# EAGLE schematic surfaceRX (EAGLE 6.2)
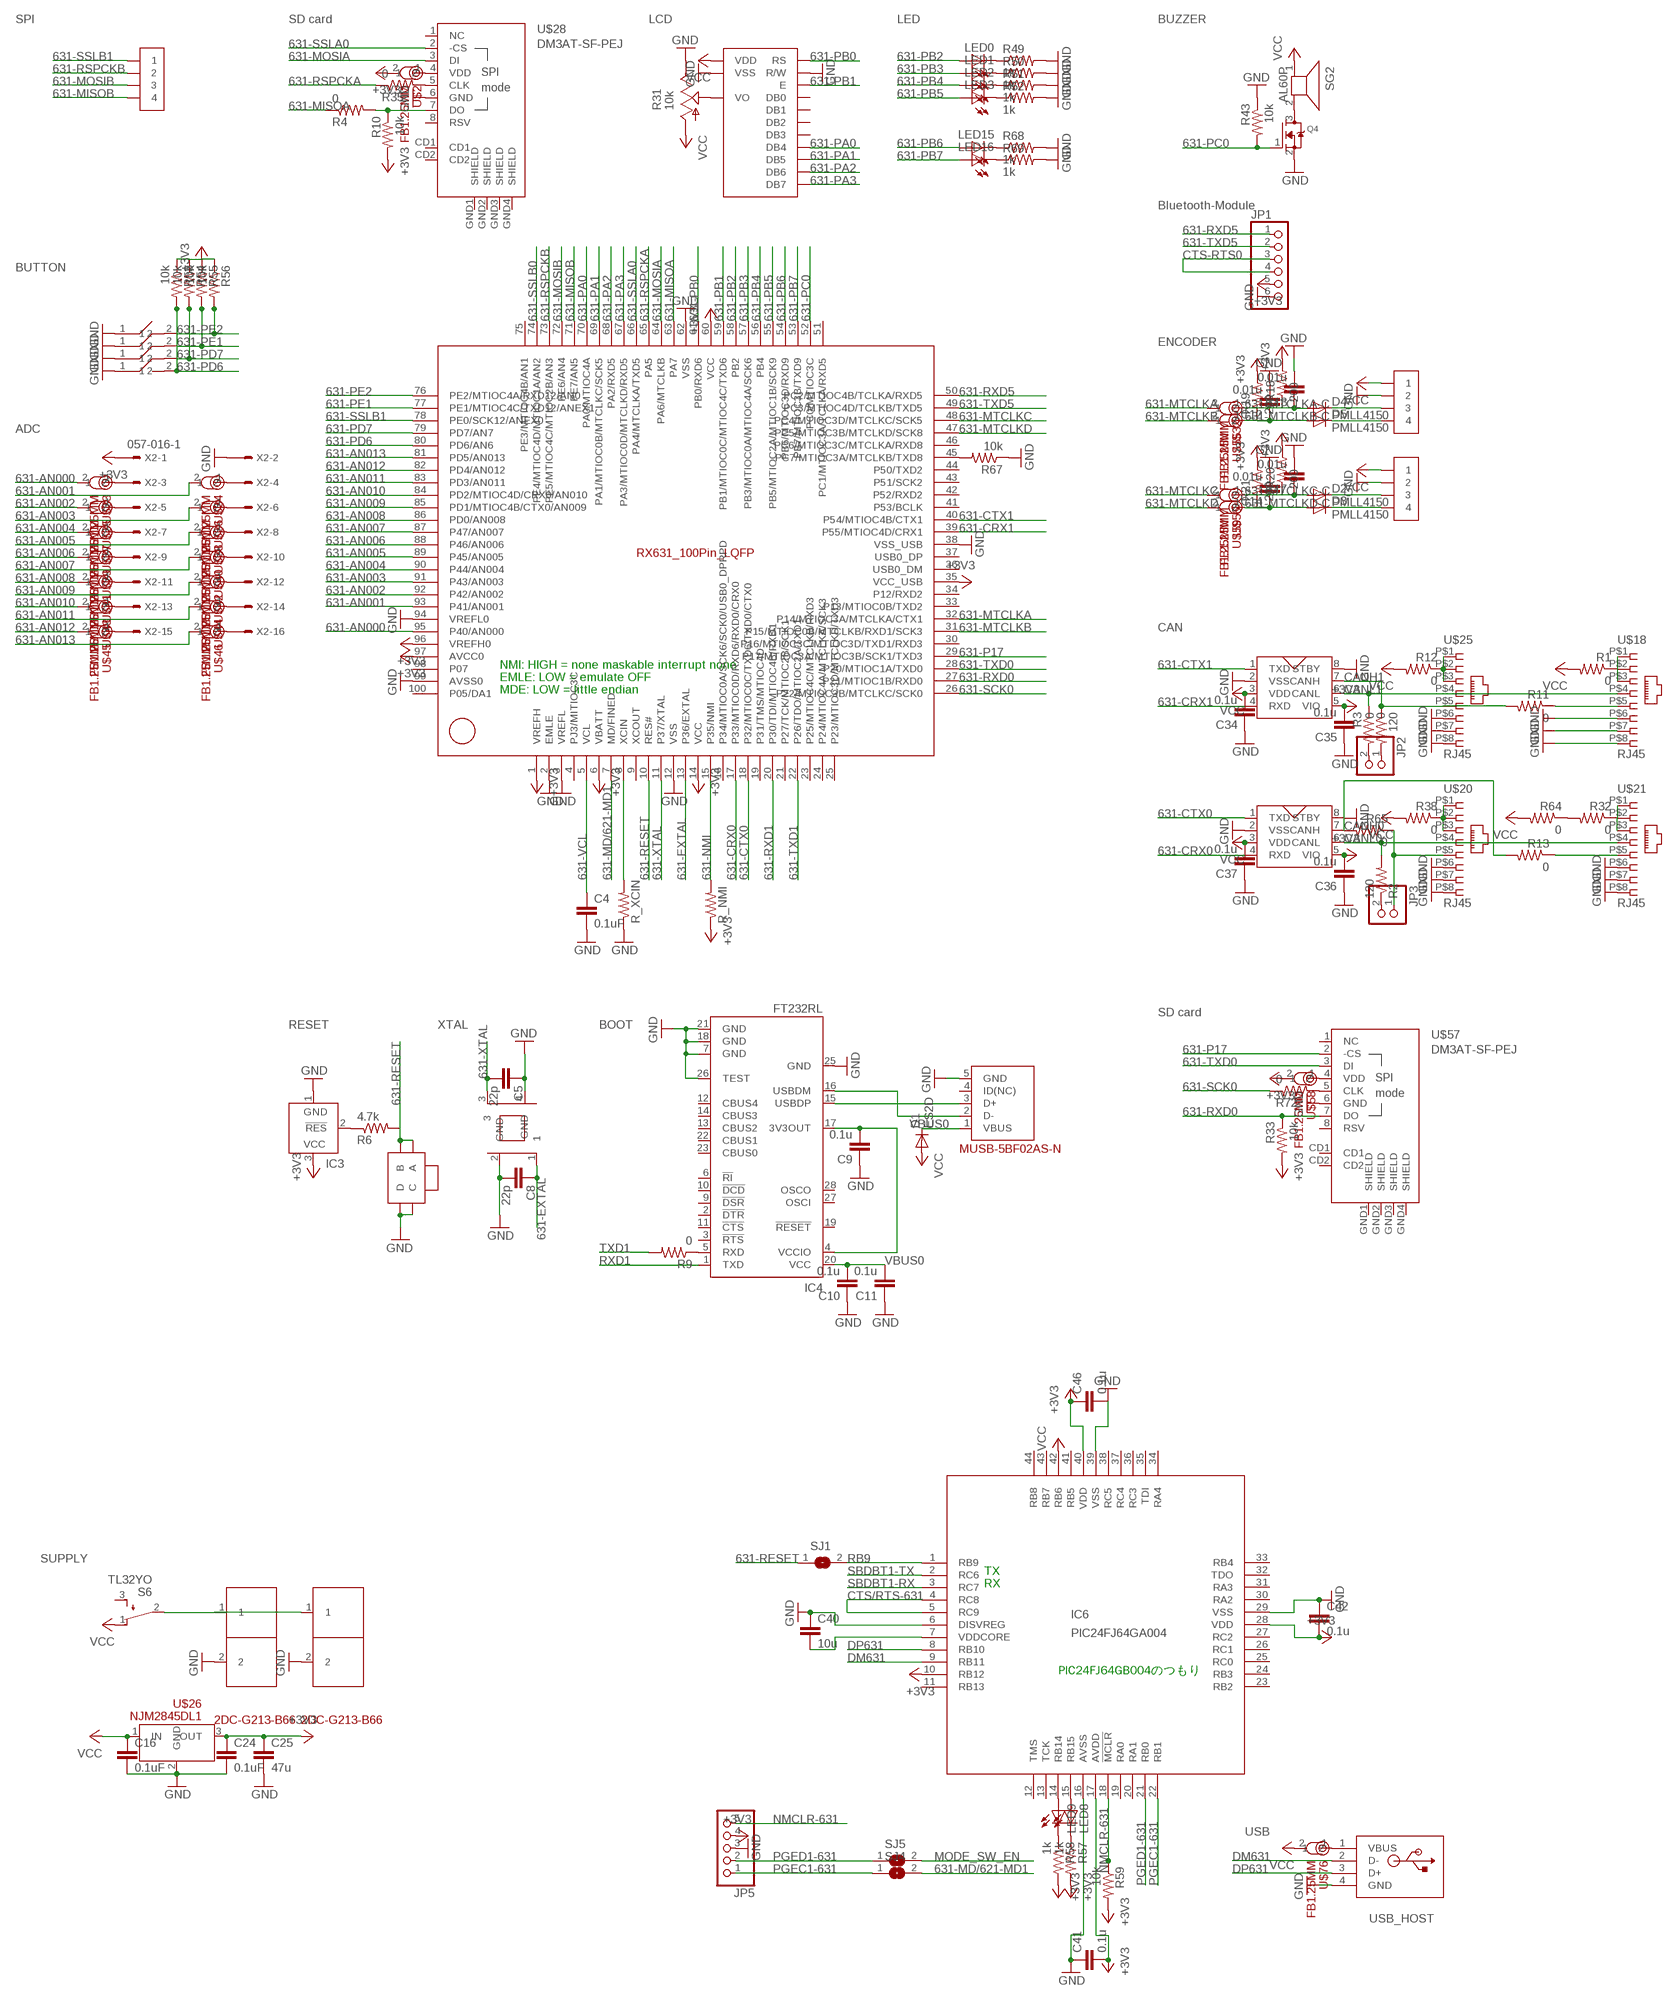
[diagram p0: schematic, sheet 1, part 1 of 2]
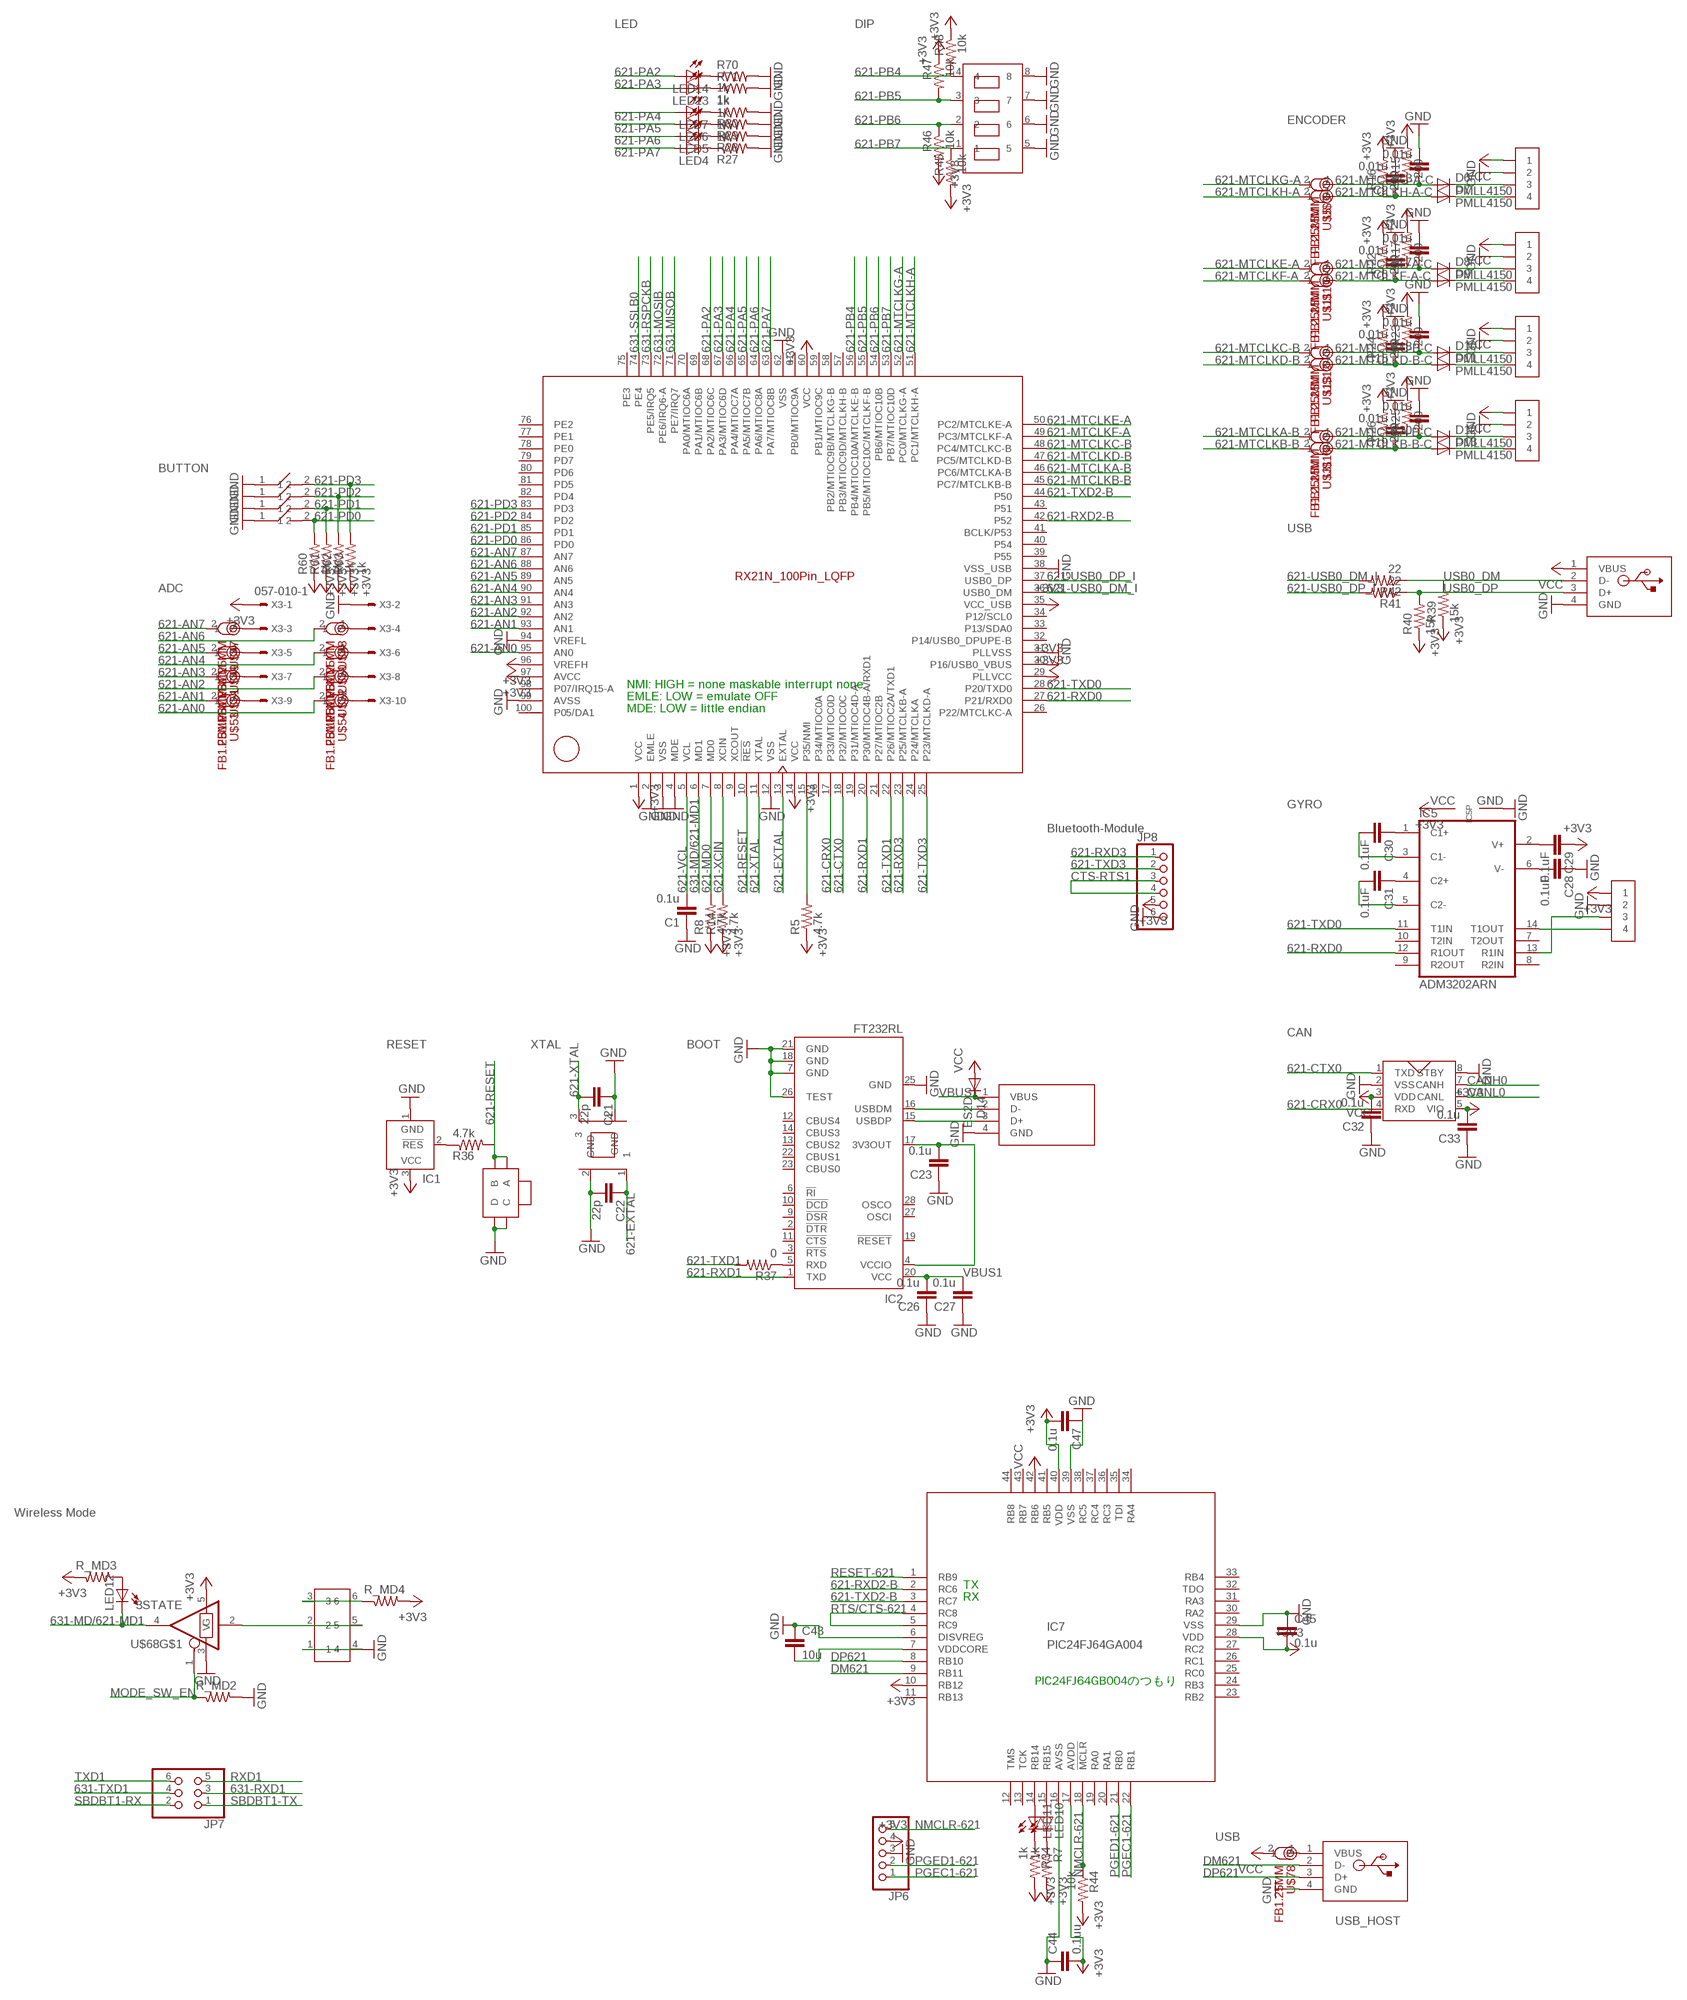
[diagram p1: schematic, sheet 1, part 2 of 2]

## Parts
0  120  R-US_MELF0102W  [MINI_MELF-0102W]
C1  0.1u  C-EUC0402  [C0402]
C2  0.01u  C-EUC0402  [C0402]
C3  0.01u  C-EUC0402  [C0402]
C4  0.1uF  C-EUC0603K  [C0603K]
C5  22p  C-EUC0603K  [C0603K]
C6  0.01u  C-EUC0402  [C0402]
C7  0.01u  C-EUC0402  [C0402]
C8  22p  C-EUC0603K  [C0603K]
C9  0.1u  C-EUC0402  [C0402]
C10  0.1u  C-EUC0402  [C0402]
C11  0.1u  C-EUC0402  [C0402]
C12  0.01u  C-EUC0402  [C0402]
C13  0.01u  C-EUC0402  [C0402]
C14  0.01u  C-EUC0402  [C0402]
C15  0.01u  C-EUC0402  [C0402]
C16  0.1uF  C-EUC0603K  [C0603K]
C17  0.01u  C-EUC0402  [C0402]
C18  0.01u  C-EUC0402  [C0402]
C19  0.01u  C-EUC0402  [C0402]
C20  0.01u  C-EUC0402  [C0402]
C21  22p  C-EUC0603K  [C0603K]
C22  22p  C-EUC0603K  [C0603K]
C23  0.1u  C-EUC0402  [C0402]
C24  0.1uF  C-EUC0603K  [C0603K]
C25  47u  C-EUC3225  [C3225]
C26  0.1u  C-EUC0402  [C0402]
C27  0.1u  C-EUC0402  [C0402]
C28  0.1uF  C-EUC0603K  [C0603K]
C29  0.1uF  C-EUC0603K  [C0603K]
C30  0.1uF  C-EUC0603K  [C0603K]
C31  0.1uF  C-EUC0603K  [C0603K]
C32  0.1u  C-EUC0402  [C0402]
C33  0.1u  C-EUC0402  [C0402]
C34  0.1u  C-EUC0402  [C0402]
C35  0.1u  C-EUC0402  [C0402]
C36  0.1u  C-EUC0402  [C0402]
C37  0.1u  C-EUC0402  [C0402]
C40  10u  C-EUC0603K  [C0603K]
C41  0.1u  C-EUC0603K  [C0603K]
C42  0.1u  C-EUC0603K  [C0603K]
C43  10u  C-EUC0603K  [C0603K]
C44  0.1uu  C-EUC0603K  [C0603K]
C45  0.1u  C-EUC0603K  [C0603K]
C46  0.1u  C-EUC0603K  [C0603K]
C47  0.1u  C-EUC0603K  [C0603K]
D1  ES2D  [SMB]
D2  PMLL4150  [SOD80C]
D3  PMLL4150  [SOD80C]
D4  PMLL4150  [SOD80C]
D5  PMLL4150  [SOD80C]
D6  PMLL4150  [SOD80C]
D7  PMLL4150  [SOD80C]
D8  PMLL4150  [SOD80C]
D9  PMLL4150  [SOD80C]
D10  PMLL4150  [SOD80C]
D11  PMLL4150  [SOD80C]
D12  PMLL4150  [SOD80C]
D13  PMLL4150  [SOD80C]
D14  ES2D  [SMB]
IC1  TCM809  [SOT23B-3]
IC2  FT232RL  [SSOP28]
IC3  TCM809  [SOT23B-3]
IC4  FT232RL  [SSOP28]
IC5  ADM3202ARN  [SO16]
IC6  PIC24FJ64GA004  [TQFP44]
IC7  PIC24FJ64GA004  [TQFP44]
JP1  PINHD-1X6  [1X06]
JP2  PINHD-1X2  [1X02]
JP3  PINHD-1X2  [1X02]
JP5  PINHD-1X5  [1X05]
JP6  PINHD-1X5  [1X05]
JP7  PINHD-2X3  [2X03]
JP8  PINHD-1X6  [1X06]
LED0  LEDSML0805  [SML0805]
LED1  LEDSML0805  [SML0805]
LED2  LEDSML0805  [SML0805]
LED3  LEDSML0805  [SML0805]
LED4  LEDSML0805  [SML0805]
LED5  LEDSML0805  [SML0805]
LED6  LEDSML0805  [SML0805]
LED7  LEDSML0805  [SML0805]
LED8  LEDSML0805  [SML0805]
LED9  LEDSML0805  [SML0805]
LED10  LEDSML0805  [SML0805]
LED11  LEDSML0805  [SML0805]
LED12  LEDSML0805  [SML0805]
LED13  LEDSML0805  [SML0805]
LED14  LEDSML0805  [SML0805]
LED15  LEDSML0805  [SML0805]
LED16  LEDSML0805  [SML0805]
MCU1  R5F562N8BDFP  [LQFP100]
Q4  MOSFET-NREFLOW  [SOT23]
R1  0  R-US_MELF0102W  [MINI_MELF-0102W]
R2  120  R-US_MELF0102W  [MINI_MELF-0102W]
R3  0  R-US_MELF0102W  [MINI_MELF-0102W]
R4  0  R-US_MELF0102W  [MINI_MELF-0102W]
R5  4.7k  R-US_MELF0102W  [MINI_MELF-0102W]
R6  4.7k  R-US_MELF0102W  [MINI_MELF-0102W]
R7  1k  R-US_MELF0102W  [MINI_MELF-0102W]
R8  4.7k  R-US_MELF0102W  [MINI_MELF-0102W]
R9  0  R-US_MELF0102W  [MINI_MELF-0102W]
R10  10k  R-US_MELF0102W  [MINI_MELF-0102W]
R11  0  R-US_MELF0102W  [MINI_MELF-0102W]
R12  0  R-US_MELF0102W  [MINI_MELF-0102W]
R13  0  R-US_MELF0102W  [MINI_MELF-0102W]
R14  4.7k  R-US_MELF0102W  [MINI_MELF-0102W]
R15  200  R-US_MELF0102W  [MINI_MELF-0102W]
R16  200  R-US_MELF0102W  [MINI_MELF-0102W]
R17  200  R-US_MELF0102W  [MINI_MELF-0102W]
R18  200  R-US_MELF0102W  [MINI_MELF-0102W]
R19  200  R-US_MELF0102W  [MINI_MELF-0102W]
R20  200  R-US_MELF0102W  [MINI_MELF-0102W]
R21  200  R-US_MELF0102W  [MINI_MELF-0102W]
R22  200  R-US_MELF0102W  [MINI_MELF-0102W]
R23  200  R-US_MELF0102W  [MINI_MELF-0102W]
R24  200  R-US_MELF0102W  [MINI_MELF-0102W]
R25  200  R-US_MELF0102W  [MINI_MELF-0102W]
R26  200  R-US_MELF0102W  [MINI_MELF-0102W]
R27  1k  R-US_MELF0102W  [MINI_MELF-0102W]
R28  1k  R-US_MELF0102W  [MINI_MELF-0102W]
R29  1k  R-US_MELF0102W  [MINI_MELF-0102W]
R30  1k  R-US_MELF0102W  [MINI_MELF-0102W]
R31  10k  TRIM_US-CA6V  [CA6V]
R32  0  R-US_MELF0102W  [MINI_MELF-0102W]
R33  10k  R-US_MELF0102W  [MINI_MELF-0102W]
R34  1k  R-US_MELF0102W  [MINI_MELF-0102W]
R35  0  R-US_MELF0102W  [MINI_MELF-0102W]
R36  4.7k  R-US_MELF0102W  [MINI_MELF-0102W]
R37  0  R-US_MELF0102W  [MINI_MELF-0102W]
R38  0  R-US_MELF0102W  [MINI_MELF-0102W]
R39  15k  R-US_MELF0102W  [MINI_MELF-0102W]
R40  15k  R-US_MELF0102W  [MINI_MELF-0102W]
R41  22  R-US_MELF0102W  [MINI_MELF-0102W]
R42  22  R-US_MELF0102W  [MINI_MELF-0102W]
R43  10k  R-US_MELF0102W  [MINI_MELF-0102W]
R44  10k  R-US_MELF0102W  [MINI_MELF-0102W]
R45  10k  R-US_MELF0102W  [MINI_MELF-0102W]
R46  10k  R-US_MELF0102W  [MINI_MELF-0102W]
R47  10k  R-US_MELF0102W  [MINI_MELF-0102W]
R48  10k  R-US_MELF0102W  [MINI_MELF-0102W]
R49  1k  R-US_MELF0102W  [MINI_MELF-0102W]
R50  1k  R-US_MELF0102W  [MINI_MELF-0102W]
R51  1k  R-US_MELF0102W  [MINI_MELF-0102W]
R52  1k  R-US_MELF0102W  [MINI_MELF-0102W]
R53  10k  R-US_MELF0102W  [MINI_MELF-0102W]
R54  10k  R-US_MELF0102W  [MINI_MELF-0102W]
R55  10k  R-US_MELF0102W  [MINI_MELF-0102W]
R56  10k  R-US_MELF0102W  [MINI_MELF-0102W]
R57  1k  R-US_MELF0102W  [MINI_MELF-0102W]
R58  1k  R-US_MELF0102W  [MINI_MELF-0102W]
R59  10k  R-US_MELF0102W  [MINI_MELF-0102W]
R60  1k  R-US_MELF0102W  [MINI_MELF-0102W]
R61  1k  R-US_MELF0102W  [MINI_MELF-0102W]
R62  1k  R-US_MELF0102W  [MINI_MELF-0102W]
R63  1k  R-US_MELF0102W  [MINI_MELF-0102W]
R64  0  R-US_MELF0102W  [MINI_MELF-0102W]
R65  0  R-US_MELF0102W  [MINI_MELF-0102W]
R67  10k  R-US_MELF0102W  [MINI_MELF-0102W]
R68  1k  R-US_MELF0102W  [MINI_MELF-0102W]
R69  1k  R-US_MELF0102W  [MINI_MELF-0102W]
R70  1k  R-US_MELF0102W  [MINI_MELF-0102W]
R71  1k  R-US_MELF0102W  [MINI_MELF-0102W]
R72  0  R-US_MELF0102W  [MINI_MELF-0102W]
R_MD2  R-US_MELF0102W  [MINI_MELF-0102W]
R_MD3  R-US_MELF0102W  [MINI_MELF-0102W]
R_MD4  R-US_MELF0102W  [MINI_MELF-0102W]
R_NMI  R-US_MELF0102W  [MINI_MELF-0102W]
R_XCIN  R-US_MELF0102W  [MINI_MELF-0102W]
S6  TL32YO  [TL3XYO]
SG2  AL60P  [AL60P]
SJ1  SJ  [SJ]
SJ4  SJ  [SJ]
SJ5  SJ  [SJ]
U$1  GHTOP4  [GHTOP4]
U$2  FB1.25MM  [2012]
U$3  FB1.25MM  [2012]
U$4  R5F5631FDDFP  [LQFP100]
U$5  FB1.25MM  [2012]
U$6  TSHA-T-2  [TSHA-T-2]
U$8  TSHA-T-2  [TSHA-T-2]
U$9  MUSB-5BF02AS-N  [MUSB-5BF02AS-N]
U$10  FB1.25MM  [2012]
U$11  FB1.25MM  [2012]
U$12  FB1.25MM  [2012]
U$13  FB1.25MM  [2012]
U$14  GHTOP4  [GHTOP4]
U$15  GHTOP4  [GHTOP4]
U$16  FB1.25MM  [2012]
U$17  MCP2562  [MCP2562]
U$18  RJ45  [RJ45]
U$19  MCP2562  [MCP2562]
U$20  RJ45  [RJ45]
U$21  RJ45  [RJ45]
U$22  2DC-G213-B66  [2DC-G213-B66]
U$23  2DC-G213-B66  [2DC-G213-B66]
U$24  GHTOP4  [GHTOP4]
U$25  RJ45  [RJ45]
U$26  NJM2845DL1  [TO-252-3-L1]
U$27  GHTOP4  [GHTOP4]
U$28  DM3AT-SF-PEJ  [DM3AT-SF-PEJ]
U$29  GHTOP4  [GHTOP4]
U$30  GHTOP4  [GHTOP4]
U$31  FB1.25MM  [2012]
U$32  FB1.25MM  [2012]
U$33  FB1.25MM  [2012]
U$34  FB1.25MM  [2012]
U$35  FB1.25MM  [2012]
U$36  FB1.25MM  [2012]
U$37  FB1.25MM  [2012]
U$38  FB1.25MM  [2012]
U$39  FB1.25MM  [2012]
U$40  FB1.25MM  [2012]
U$41  FB1.25MM  [2012]
U$42  FB1.25MM  [2012]
U$43  FB1.25MM  [2012]
U$44  FB1.25MM  [2012]
U$45  FB1.25MM  [2012]
U$46  FB1.25MM  [2012]
U$47  FB1.25MM  [2012]
U$48  FB1.25MM  [2012]
U$49  FB1.25MM  [2012]
U$50  FB1.25MM  [2012]
U$51  FB1.25MM  [2012]
U$52  FB1.25MM  [2012]
U$53  FB1.25MM  [2012]
U$54  FB1.25MM  [2012]
U$55  FB1.25MM  [2012]
U$56  FB1.25MM  [2012]
U$57  DM3AT-SF-PEJ  [DM3AT-SF-PEJ]
U$58  FB1.25MM  [2012]
U$59  FB1.25MM  [2012]
U$61  FA238V  [FA238V]
U$62  FA238V  [FA238V]
U$63  USB-TYPEB  [USB-TYPEB]
U$64  MCP2562  [MCP2562]
U$65  SC1602BBWB_PAD  [SC1602BBWB_PAD]
U$66  TVBP06  [TVBP06]
U$67  USB_A  [USB_A]
U$68  3STATE  [SOT23-5]
U$69  TVBP06  [TVBP06]
U$70  TVBP06  [TVBP06]
U$71  TVBP06  [TVBP06]
U$72  TVBP06  [TVBP06]
U$73  TVBP06  [TVBP06]
U$74  TVBP06  [TVBP06]
U$75  USB_A  [USB_A]
U$76  FB1.25MM  [2012]
U$77  USB_A  [USB_A]
U$78  FB1.25MM  [2012]
U$79  KHS42  [KHS42]
U$80  GHTOP4  [GHTOP4]
U$81  TVBP06  [TVBP06]
U$82  SSSS2  [SSSS2]
X2  057-016-1  [057-016-1]
X3  057-010-1  [057-010-1]

## Nets
621-AN0: MCU1.95(AN0) U$54.2
621-AN1: MCU1.93(AN1) U$53.2
621-AN2: MCU1.92(AN2) U$52.2
621-AN3: MCU1.91(AN3) U$51.2
621-AN4: MCU1.90(AN4) U$50.2
621-AN5: MCU1.89(AN5) U$49.2
621-AN6: MCU1.88(AN6) U$48.2
621-AN7: MCU1.87(AN7) U$47.2
621-CRX0: MCU1.17(P33/MTIOC0D) U$64.4(RXD)
621-CTX0: MCU1.18(P32/MTIOC0C) U$64.1(TXD)
621-EXTAL: C22.1 MCU1.13(EXTAL) U$62.1
621-MD0: MCU1.7(MD0) R8.2
621-MTCLKA-B: MCU1.46(PC6/MTCLKA-B) U$16.2
621-MTCLKA-B-C: C20.1 D12.A R25.1 U$16.1
621-MTCLKB-B: MCU1.45(PC7/MTCLKB-B) U$31.2
621-MTCLKB-B-C: C19.1 D13.A R26.1 U$31.1
621-MTCLKC-B: MCU1.48(PC4/MTCLKC-B) U$12.2
621-MTCLKC-B-C: C18.1 D10.A R23.1 U$12.1
621-MTCLKD-B: MCU1.47(PC5/MTCLKD-B) U$13.2
621-MTCLKD-B-C: C15.1 D11.A R24.1 U$13.1
621-MTCLKE-A: MCU1.50(PC2/MTCLKE-A) U$10.2
621-MTCLKE-A-C: C7.1 D8.A R17.1 U$10.1
621-MTCLKF-A: MCU1.49(PC3/MTCLKF-A) U$11.2
621-MTCLKF-A-C: C6.1 D9.A R22.1 U$11.1
621-MTCLKG-A: MCU1.52(PC0/MTCLKG-A) U$3.2
621-MTCLKG-A-C: C3.1 D6.A R15.1 U$3.1
621-MTCLKH-A: MCU1.51(PC1/MTCLKH-A) U$5.2
621-MTCLKH-A-C: C2.1 D7.A R16.1 U$5.1
621-PA2: LED14.A MCU1.68(PA2/MTIOC6C)
621-PA3: LED13.A MCU1.67(PA3/MTIOC6D)
621-PA4: LED7.A MCU1.66(PA4/MTIOC7A)
621-PA5: LED6.A MCU1.65(PA5/MTIOC7B)
621-PA6: LED5.A MCU1.64(PA6/MTIOC8A)
621-PA7: LED4.A MCU1.63(PA7/MTIOC8B)
621-PB4: MCU1.56(PB4/MTIOC10A/MTCLKE-B) R48.2 U$79.4
621-PB5: MCU1.55(PB5/MTIOC10C/MTCLKF-B) R47.2 U$79.3
621-PB6: MCU1.54(PB6/MTIOC10B) R46.1 U$79.2
621-PB7: MCU1.53(PB7/MTIOC10D) R45.1 U$79.1
621-PD0: MCU1.86(PD0) R60.2 U$81.2
621-PD1: MCU1.85(PD1) R61.2 U$74.2
621-PD2: MCU1.84(PD2) R62.2 U$73.2
621-PD3: MCU1.83(PD3) R63.2 U$72.2
621-RESET: MCU1.10(!RES) R36.2 U$8.A U$8.B
621-RXD0: IC5.12(R1OUT) MCU1.27(P21/RXD0)
621-RXD1: IC2.1(TXD) MCU1.20(P30/MTIOC4B-A/RXD1)
621-RXD2-B: IC7.2(RC6) MCU1.42(P52)
621-RXD3: JP8.1 MCU1.23(P25/MTCLKB-A)
621-TXD0: IC5.11(T1IN) MCU1.28(P20/TXD0)
621-TXD1: MCU1.22(P26/MTIOC2A/TXD1) R37.2
621-TXD2-B: IC7.3(RC7) MCU1.44(P50)
621-TXD3: JP8.2 MCU1.25(P23/MTCLKD-A)
621-USB0_DM_I: MCU1.36(USB0_DM) R42.2
621-USB0_DP_I: MCU1.37(USB0_DP) R41.2
621-VCL: C1.2 MCU1.5(VCL)
621-XCIN: MCU1.8(XCIN) R14.2
621-XTAL: C21.2 MCU1.11(XTAL) U$62.3
631-AN000: U$4.95(P40/AN000) U$33.2
631-AN001: U$4.93(P41/AN001) U$34.2
631-AN002: U$4.92(P42/AN002) U$35.2
631-AN003: U$4.91(P43/AN003) U$36.2
631-AN004: U$4.90(P44/AN004) U$37.2
631-AN005: U$4.89(P45/AN005) U$38.2
631-AN006: U$4.88(P46/AN006) U$39.2
631-AN007: U$4.87(P47/AN007) U$40.2
631-AN008: U$4.86(PD0/AN008) U$41.2
631-AN009: U$4.85(PD1/MTIOC4B/CTX0/AN009) U$42.2
631-AN010: U$4.84(PD2/MTIOC4D/CRX0/AN010) U$43.2
631-AN011: U$4.83(PD3/AN011) U$44.2
631-AN012: U$4.82(PD4/AN012) U$45.2
631-AN013: U$4.81(PD5/AN013) U$46.2
631-CRX0: U$4.17(P33/MTIOC0D/RXD6/RXD0/CRX0) U$19.4(RXD)
631-CRX1: U$4.39(P55/MTIOC4D/CRX1) U$17.4(RXD)
631-CTX0: U$4.18(P32/MTIOC0C/TXD6/TXD0/CTX0) U$19.1(TXD)
631-CTX1: U$4.40(P54/MTIOC4B/CTX1) U$17.1(TXD)
631-EXTAL: C8.1 U$4.13(P36/EXTAL) U$61.1
631-MD/621-MD1: LED12.C MCU1.6(MD1) SJ4.2 U$4.7(MD/FINED) U$68.4(O)
631-MISOA: R4.1 U$4.63(PA7)
631-MISOB: MCU1.71(PE7/IRQ7) U$1.4 U$4.71(PE7/AN5)
631-MOSIA: U$4.64(PA6/MTCLKB) U$28.3(DI)
631-MOSIB: MCU1.72(PE6/IRQ6-A) U$1.3 U$4.72(PE6/AN4)
631-MTCLKA: U$4.32(P14/MTIOC3A/MTCLKA/CTX1) U$32.2
631-MTCLKA-C: C13.1 D4.A R18.1 U$32.1
631-MTCLKB: U$4.31(P15/MTIOC0B/MTCLKB/RXD1/SCK3) U$55.2
631-MTCLKB-C: C12.1 D5.A R19.1 U$55.1
631-MTCLKC: U$4.48(PC4/MTIOC3D/MTCLKC/SCK5) U$56.2
631-MTCLKC-C: C17.1 D2.A R20.1 U$56.1
631-MTCLKD: U$4.47(PC5/MTIOC3B/MTCLKD/SCK8) U$59.2
631-MTCLKD-C: C14.1 D3.A R21.1 U$59.1
631-NMI: R_NMI.2 U$4.15(P35/NMI)
631-P17: U$4.29(P17/MTIOC3A/MTIOC3B/SCK1/TXD3) U$57.2(-CS)
631-PA0: U$4.70(PA0/MTIOC4A) U$65.11(DB4)
631-PA1: U$4.69(PA1/MTIOC0B/MTCLKC/SCK5) U$65.12(DB5)
631-PA2: U$4.68(PA2/RXD5) U$65.13(DB6)
631-PA3: U$4.67(PA3/MTIOC0D/MTCLKD/RXD5) U$65.14(DB7)
631-PB0: U$4.61(PB0/RXD6) U$65.4(RS)
631-PB1: U$4.59(PB1/MTIOC0C/MTIOC4C/TXD6) U$65.6(E)
631-PB2: LED0.A U$4.58(PB2)
631-PB3: LED1.A U$4.57(PB3/MTIOC0A/MTIOC4A/SCK6)
631-PB4: LED2.A U$4.56(PB4)
631-PB5: LED3.A U$4.55(PB5/MTIOC2A/MTIOC1B/SCK9)
631-PB6: LED15.A U$4.54(PB6/MTIOC3D/RXD9)
631-PB7: LED16.A U$4.53(PB7/MTIOC3B/TXD9)
631-PC0: Q4.1(G) R43.2 U$4.52(PC0/MTIOC3C)
631-PD6: R53.2 U$4.80(PD6/AN6) U$71.2
631-PD7: R54.2 U$4.79(PD7/AN7) U$70.2
631-PE1: R55.2 U$4.77(PE1/MTIOC4C/TXD12/ANEX1) U$69.2
631-PE2: R56.2 U$4.76(PE2/MTIOC4A/RXD12/AN0) U$66.2
631-RESET: R6.2 SJ1.1 U$4.10(RES#) U$6.A U$6.B
631-RSPCKA: R35.1 U$4.65(PA5)
631-RSPCKB: MCU1.73(PE5/IRQ5) U$1.2 U$4.73(PE5/MTIOC4C/MTIOC2B/AN3)
631-RXD0: R33.1 U$4.27(P21/MTIOC1B/RXD0) U$57.7(DO)
631-RXD1: JP7.3 U$4.20(P30/TDI/MTIOC4B/RXD1)
631-RXD5: JP1.1 U$4.50(PC2/MTIOC4B/TCLKA/RXD5)
631-SCK0: R72.1 U$4.26(P22/MTIOC3B/MTCLKC/SCK0)
631-SSLA0: U$4.66(PA4/MTCLKA/TXD5) U$28.2(-CS)
631-SSLB0: MCU1.74(PE4) U$4.74(PE4/MTIOC4D/MTIOC1A/AN2)
631-SSLB1: U$1.1 U$4.78(PE0/SCK12/ANEX0)
631-TXD0: U$4.28(P20/MTIOC1A/TXD0) U$57.3(DI)
631-TXD1: JP7.4 U$4.22(P26/TDO/MTIOC2A/TXD1)
631-TXD5: JP1.2 U$4.49(PC3/MTIOC4D/TCLKB/TXD5)
631-VCL: C4.1 U$4.5(VCL)
631-XTAL: C5.2 U$4.11(P37/XTAL) U$61.3
+3V3: C24.1 C25.1 C29.1 C33.2 C35.2 C36.2 C41.2 C42.2 C44.2 C45.2 C46.1 C47.2 IC1.3(VCC) IC3.3(VCC) IC5.16(VCC) IC6.10(RB12) IC6.17(AVDD) IC6.28(VDD) IC6.40(VDD) IC7.10(RB12) IC7.17(AVDD) IC7.28(VDD) IC7.40(VDD) JP1.5 JP5.4 JP6.4 JP8.5 MCU1.1(VCC) MCU1.14(VCC) MCU1.29(PLLVCC) MCU1.30(P16/USB0_VBUS) MCU1.35(VCC_USB) MCU1.60(VCC) MCU1.96(VREFH) MCU1.97(AVCC) R5.1 R7.2 R8.1 R10.2 R14.1 R15.2 R16.2 R17.2 R18.2 R19.2 R20.2 R21.2 R22.2 R23.2 R24.2 R25.2 R26.2 R33.2 R34.2 R39.1 R40.1 R44.2 R45.2 R46.2 R47.1 R48.1 R53.1 R54.1 R55.1 R56.1 R57.2 R58.2 R59.2 R60.1 R61.1 R62.1 R63.1 R_MD3.2 R_MD4.1 R_NMI.1 U$2.2 U$4.1(VREFH) U$4.6(VBATT) U$4.14(VCC) U$4.35(VCC_USB) U$4.60(VCC) U$4.96(VREFH0) U$4.97(AVCC0) U$17.5(VIO) U$19.5(VIO) U$26.3(OUT) U$58.2 U$64.5(VIO) U$68.5(V) U$80.1 X2.1 X3.1
CANH0: JP3.1 R65.1 U$20.P$5 U$64.7(CANH)
CANH1: 0.1 R11.2 U$17.7(CANH) U$25.P$5
CANL0: R2.2 U$19.6(CANL) U$20.P$4 U$21.P$4 U$64.6(CANL)
CANL1: R3.1 U$17.6(CANL) U$18.P$4 U$25.P$4
CTS-RTS0: JP1.3 JP1.4
CTS-RTS1: JP8.3 JP8.4
CTS/RTS-631: IC6.4(RC8) IC6.5(RC9)
DM: IC2.16(USBDM) U$63.2(D-)
DM621: IC7.9(RB11) U$77.2(D-)
DM631: IC6.9(RB11) U$75.2(D-)
DP: IC2.15(USBDP) U$63.3(D+)
DP621: IC7.8(RB10) U$77.3(D+)
DP631: IC6.8(RB10) U$75.3(D+)
GND: C1.1 C2.2 C3.2 C4.2 C5.1 C6.2 C7.2 C8.2 C9.1 C10.1 C11.1 C12.2 C13.2 C14.2 C15.2 C16.2 C17.2 C18.2 C19.2 C20.2 C21.1 C22.2 C23.1 C24.2 C25.2 C26.1 C27.1 C28.1 C32.1 C33.1 C34.1 C35.1 C36.1 C37.1 C40.1 C41.1 C42.1 C43.1 C44.1 C45.1 C46.2 C47.1 IC1.1(GND) IC2.7(GND) IC2.18(GND) IC2.21(GND) IC2.25(GND) IC2.26(TEST) IC3.1(GND) IC4.7(GND) IC4.18(GND) IC4.21(GND) IC4.25(GND) IC4.26(TEST) IC5.15(GND) IC6.6(DISVREG) IC6.16(AVSS) IC6.29(VSS) IC6.39(VSS) IC7.6(DISVREG) IC7.16(AVSS) IC7.29(VSS) IC7.39(VSS) JP1.6 JP5.3 JP6.3 JP8.6 MCU1.2(EMLE) MCU1.3(VSS) MCU1.4(MDE) MCU1.12(VSS) MCU1.31(PLLVSS) MCU1.38(VSS_USB) MCU1.62(VSS) MCU1.94(VREFL) MCU1.99(AVSS) Q4.2(S) R27.2 R28.2 R29.2 R30.2 R31.E R43.1 R49.2 R50.2 R51.2 R52.2 R67.1 R68.2 R69.2 R70.2 R71.2 R_MD2.1 R_XCIN.1 U$4.2(EMLE) U$4.3(VREFL) U$4.12(VSS) U$4.38(VSS_USB) U$4.62(VSS) U$4.94(VREFL0) U$4.99(AVSS0) U$6.C U$6.D U$8.C U$8.D U$9.5(GND) U$14.2 U$15.2 U$17.2(VSS) U$17.8(STBY) U$18.P$6 U$18.P$7 U$18.P$8 U$19.2(VSS) U$19.8(STBY) U$20.P$6 U$20.P$7 U$20.P$8 U$21.P$6 U$21.P$7 U$21.P$8 U$22.2 U$23.2 U$24.2 U$25.P$6 U$25.P$7 U$25.P$8 U$26.2(GND) U$27.2 U$28.6(GND) U$29.2 U$30.2 U$57.6(GND) U$61.2(GND) U$61.4(GND) U$62.2(GND) U$62.4(GND) U$63.4(GND) U$64.2(VSS) U$64.8(STBY) U$65.2(VSS) U$65.5(R/W) U$66.1 U$67.4(GND) U$68.3(G) U$69.1 U$70.1 U$71.1 U$72.1 U$73.1 U$74.1 U$75.4(GND) U$77.4(GND) U$79.5 U$79.6 U$79.7 U$79.8 U$80.2 U$81.1 U$82.1 U$82.4 X2.2 X3.2
MODE_SW_EN: R_MD2.2 SJ5.2 U$68.1(OE)
N$1: R4.2 R10.1 U$28.7(DO)
N$2: U$2.1 U$28.4(VDD)
N$3: R31.S U$65.3(VO)
N$4: LED12.A R_MD3.1
N$5: R_XCIN.2 U$4.8(XCIN)
N$6: IC3.2(!RES) R6.1
N$7: R1.1 U$18.P$1 U$18.P$2 U$18.P$3
N$8: R11.1 U$18.P$5
N$9: R35.2 U$28.5(CLK)
N$10: R72.2 U$57.5(CLK)
N$11: IC4.16(USBDM) U$9.2(D-)
N$12: IC4.15(USBDP) U$9.3(D+)
N$13: C9.2 IC4.4(VCCIO) IC4.17(3V3OUT)
N$14: IC4.5(RXD) R9.1
N$15: JP2.2 R3.2
N$16: R12.1 U$25.P$1 U$25.P$2 U$25.P$3
N$17: D2.C U$15.3
N$18: R13.1 U$21.P$5
N$19: D3.C U$15.4
N$20: D5.C U$14.4
N$21: D4.C U$14.3
N$22: R32.1 U$21.P$1 U$21.P$2 U$21.P$3
N$23: JP3.2 R2.1
N$24: S6.2(P) U$22.1 U$23.1
N$25: MCU1.15(P35/NMI) R5.2
N$26: D7.C U$24.4
N$27: D6.C U$24.3
N$28: D8.C U$27.3
N$29: D9.C U$27.4
N$30: D11.C U$29.4
N$31: D10.C U$29.3
N$32: D12.C U$30.3
N$33: D13.C U$30.4
N$34: LED4.C R27.1
N$35: LED5.C R28.1
N$36: LED6.C R29.1
N$37: LED7.C R30.1
N$38: R38.1 U$20.P$1 U$20.P$2 U$20.P$3
N$39: U$57.4(VDD) U$58.1
N$40: R32.2 R64.1
N$41: 0.2 JP2.1
N$42: R13.2 R65.2 U$19.7(CANH)
N$43: LED13.C R71.1
N$44: U$47.1 X3.3
N$45: U$48.1 X3.4
N$46: IC1.2(!RES) R36.1
N$48: U$49.1 X3.5
N$49: U$50.1 X3.6
N$50: U$51.1 X3.7
N$51: U$52.1 X3.8
N$53: C23.2 IC2.4(VCCIO) IC2.17(3V3OUT)
N$54: IC2.5(RXD) R37.1
N$55: IC5.14(T1OUT) U$80.4
N$56: C43.2 IC7.7(VDDCORE)
N$57: U$53.1 X3.9
N$58: U$54.1 X3.10
N$59: U$33.1 X2.3
N$60: U$34.1 X2.4
N$61: U$35.1 X2.5
N$62: U$36.1 X2.6
N$63: U$37.1 X2.7
N$64: U$38.1 X2.8
N$65: U$39.1 X2.9
N$66: U$40.1 X2.10
N$67: U$41.1 X2.11
N$68: U$42.1 X2.12
N$69: U$43.1 X2.13
N$70: U$44.1 X2.14
N$71: U$45.1 X2.15
N$72: U$46.1 X2.16
N$73: LED14.C R70.1
N$74: C28.2 IC5.6(V-)
N$75: C29.2 IC5.2(V+)
N$76: C30.1 IC5.1(C1+)
N$77: Q4.3(D) SG2.2
N$78: C31.1 IC5.4(C2+)
N$79: LED0.C R49.1
N$80: R67.2 U$4.45(PC7/MTIOC3A/MTCLKB/TXD8)
N$81: LED1.C R50.1
N$82: C31.2 IC5.5(C2-)
N$83: C30.2 IC5.3(C1-)
N$84: LED2.C R51.1
N$85: LED3.C R52.1
N$86: IC5.13(R1IN) U$80.3
N$87: LED10.C R7.1
N$88: LED11.C R34.1
N$89: IC7.15(RB15) LED10.A
N$90: U$68.2(I) U$82.2 U$82.5
N$91: IC7.14(RB14) LED11.A
N$92: U$77.1(VBUS) U$78.1
N$93: LED15.C R68.1
N$94: LED16.C R69.1
N$98: LED8.C R57.1
N$99: LED9.C R58.1
N$100: IC6.15(RB15) LED8.A
N$101: IC6.14(RB14) LED9.A
N$102: C40.2 IC6.7(VDDCORE)
N$103: U$75.1(VBUS) U$76.1
N$104: R_MD4.2 U$82.3 U$82.6
NMCLR-621: IC7.18(!MCLR) JP6.5 R44.1
NMCLR-631: IC6.18(!MCLR) JP5.5 R59.1
PGEC1-621: IC7.22(RB1) JP6.1
PGEC1-631: IC6.22(RB1) JP5.1 SJ4.1
PGED1-621: IC7.21(RB0) JP6.2
PGED1-631: IC6.21(RB0) JP5.2 SJ5.1
RB9: IC6.1(RB9) SJ1.2
RESET-621: IC7.1(RB9)
RTS/CTS-621: IC7.4(RC8) IC7.5(RC9)
RXD1: IC4.1(TXD) JP7.5
SBDBT1-RX: IC6.3(RC7) JP7.2
SBDBT1-TX: IC6.2(RC6) JP7.1
TXD1: JP7.6 R9.2
USB0_DM: R39.2 R42.1 U$67.2(D-)
USB0_DP: R40.2 R41.1 U$67.3(D+)
VBUS0: C10.2 C11.2 D1.C IC4.20(VCC) U$9.1(VBUS)
VBUS1: C26.2 C27.2 D14.C IC2.20(VCC) U$63.1(VBUS)
VCC: C16.1 C32.2 C34.2 C37.2 D1.A D14.A IC6.42(RB6) IC7.42(RB6) R1.2 R12.2 R31.A R38.2 R64.2 S6.1(O) SG2.1 U$14.1 U$15.1 U$17.3(VDD) U$19.3(VDD) U$24.1 U$26.1(IN) U$27.1 U$29.1 U$30.1 U$64.3(VDD) U$65.1(VDD) U$67.1(VBUS) U$76.2 U$78.2
Unconnected: IC2.2(!DTR) IC2.3(!RTS) IC2.6(!RI) IC2.9(!DSR) IC2.10(!DCD) IC2.11(!CTS) IC2.12(CBUS4) IC2.13(CBUS2) IC2.14(CBUS3) IC2.19(!RESET) IC2.22(CBUS1) IC2.23(CBUS0) IC2.27(OSCI) IC2.28(OSCO) IC4.2(!DTR) IC4.3(!RTS) IC4.6(!RI) IC4.9(!DSR) IC4.10(!DCD) IC4.11(!CTS) IC4.12(CBUS4) IC4.13(CBUS2) IC4.14(CBUS3) IC4.19(!RESET) IC4.22(CBUS1) IC4.23(CBUS0) IC4.27(OSCI) IC4.28(OSCO) IC5.7(T2OUT) IC5.8(R2IN) IC5.9(R2OUT) IC5.10(T2IN) IC6.11(RB13) IC6.12(TMS) IC6.13(TCK) IC6.19(RA0) IC6.20(RA1) IC6.23(RB2) IC6.24(RB3) IC6.25(RC0) IC6.26(RC1) IC6.27(RC2) IC6.30(RA2) IC6.31(RA3) IC6.32(TDO) IC6.33(RB4) IC6.34(RA4) IC6.35(TDI) IC6.36(RC3) IC6.37(RC4) IC6.38(RC5) IC6.41(RB5) IC6.43(RB7) IC6.44(RB8) IC7.11(RB13) IC7.12(TMS) IC7.13(TCK) IC7.19(RA0) IC7.20(RA1) IC7.23(RB2) IC7.24(RB3) IC7.25(RC0) IC7.26(RC1) IC7.27(RC2) IC7.30(RA2) IC7.31(RA3) IC7.32(TDO) IC7.33(RB4) IC7.34(RA4) IC7.35(TDI) IC7.36(RC3) IC7.37(RC4) IC7.38(RC5) IC7.41(RB5) IC7.43(RB7) IC7.44(RB8) MCU1.9(XCOUT) MCU1.16(P34/MTIOC0A) MCU1.19(P31/MTIOC4D-A) MCU1.21(P27/MTIOC2B) MCU1.24(P24/MTCLKA) MCU1.26(P22/MTCLKC-A) MCU1.32(P14/USB0_DPUPE-B) MCU1.33(P13/SDA0) MCU1.34(P12/SCL0) MCU1.39(P55) MCU1.40(P54) MCU1.41(BCLK/P53) MCU1.43(P51) MCU1.57(PB3/MTIOC9D/MTCLKH-B) MCU1.58(PB2/MTIOC9B/MTCLKG-B) MCU1.59(PB1/MTIOC9C) MCU1.61(PB0/MTIOC9A) MCU1.69(PA1/MTIOC6B) MCU1.70(PA0/MTIOC6A) MCU1.75(PE3) MCU1.76(PE2) MCU1.77(PE1) MCU1.78(PE0) MCU1.79(PD7) MCU1.80(PD6) MCU1.81(PD5) MCU1.82(PD4) MCU1.98(P07/IRQ15-A) MCU1.100(P05/DA1) S6.3(S) U$4.4(PJ3/MITIOC3C) U$4.9(XCOUT) U$4.16(P34/MTIOC0A/SCK6/SCK0/USB0_DPRPD) U$4.19(P31/TMS/MTIOC4D) U$4.21(P27/TCK/MTIOC2B/SCK1) U$4.23(P25/MTIOC4C/MTCLKB/RXD3) U$4.24(P24/MTIOC4A/MTCLKA/SCK3) U$4.25(P23/MTIOC3D/MTCLKD/TXD3) U$4.30(P16/MTIOC3C/MTIOC3D/TXD1/RXD3) U$4.33(P13/MTIOC0B/TXD2) U$4.34(P12/RXD2) U$4.36(USB0_DM) U$4.37(USB0_DP) U$4.41(P53/BCLK) U$4.42(P52/RXD2) U$4.43(P51/SCK2) U$4.44(P50/TXD2) U$4.46(PC6/MTIOC3C/MTCLKA/RXD8) U$4.51(PC1/MTIOC3A/TCLKA/RXD5) U$4.75(PE3/MTIOC4B/AN1) U$4.98(P07) U$4.100(P05/DA1) U$9.4(ID(NC)) U$28.1(NC) U$28.8(RSV) U$28.CD1 U$28.CD2 U$28.GND1(SHIELD) U$28.GND2(SHIELD) U$28.GND3(SHIELD) U$28.GND4(SHIELD) U$57.1(NC) U$57.8(RSV) U$57.CD1 U$57.CD2 U$57.GND1(SHIELD) U$57.GND2(SHIELD) U$57.GND3(SHIELD) U$57.GND4(SHIELD) U$65.7(DB0) U$65.8(DB1) U$65.9(DB2) U$65.10(DB3)

## Notes on the sheet
- LED | DIP
- SPI | SD card | LCD | LED | BUZZER
- ENCODER
- Bluetooth-Module
- BUTTON
- ENCODER
- ADC | BUTTON
- USB
- ADC
- CAN
- NMI: HIGH = none maskable interrupt none
- NMI: HIGH = none maskable interrupt none | EMLE: LOW = emulate OFF
- EMLE: LOW = emulate OFF | MDE: LOW = little endian
- MDE: LOW = little endian
- GYRO
- Bluetooth-Module
- SD card | CAN
- RESET | XTAL | BOOT | RESET | XTAL | BOOT
- Wireless Mode
- SUPPLY
- TX
- RX | TX
- RX
- PIC24FJ64GB004のつもり
- PIC24FJ64GB004のつもり
- USB
- USB
- USB_HOST
- USB_HOST

## Library data of the parts
0 R1-R30 R32-R65 R67-R72 R_MD2-R_MD4 R_NMI R_XCIN = rcl:R-US_: RESISTOR, American symbol
C1-C37 C40-C47 = rcl:C-EU: CAPACITOR, European symbol
D1 D14 = diode:ES2D: DIODE super fast rectifier, 2 A
D2-D13 = diode:PMLL4150: DIODE high speed
IC1 IC3 = telcom:TCM809: POWER SUPPLY MONITOR replacement for Maxim MAX809 and MAX810; MF: MICROCHIP; MPN: TCM809MENB713; OC_FARNELL: 9762744; OC_NEWARK: 96K3998
IC2 IC4 = ftdichip:FT232R: Source: http://www.ftdichip.com/Documents/DataSheets/DS_FT232R_v104.pdf; MPN: FT232RL; OC_FARNELL: 1146032; OC_NEWARK: 91K9918
IC5 = ADI-variety:ADM3202*
IC6 IC7 = microchip:PIC24FJ64GA004: PIC24FJ64GA004 edit this description Auto generated by make-symbol-device-package-bsdl.ulp Rev. 25 Source: PIC24FJ64GA004.bsd; MPN: PIC24FJ64GA004-E/PT; OC_FARNELL: 1332299; OC_NEWARK: 98M1927
JP1 JP8 = pinhead:PINHD-1X6: PIN HEADER
JP2 JP3 = pinhead:PINHD-1X2: PIN HEADER
JP5 JP6 = pinhead:PINHD-1X5: PIN HEADER
JP7 = pinhead:PINHD-2X3: PIN HEADER
LED0 LED1-LED16 = led:LED: LED OSRAM: - CHIPLED LG R971, LG N971, LY N971, LG Q971, LY Q971, LO R971, LY R971 LH N974, LH R974 LS Q976, LO Q976, LY Q976 LO Q996 - Hyper CHIPLED LW Q18S LB Q993, LB Q99A, LB R99A - SideLED LS A670, LO A670, LY A670, LG A670, LP A670 LB A673, LV A673, LT A673, LW A673 LH A674 LY A675 LS A676, LA A676, LO A676, LY A676, LW A676 LS A679, LY A679, LG A679 - Hyper Micro SIDELED® LS Y876, LA Y876, LO Y876, LY Y876 LT Y87S - SmartLED LW L88C, LW L88S LB L89C, LB L89S, LG L890 LS L89K, LO L89K, LY L89K LS L896, LA L896, LO L896, LY L896 - TOPLED LS T670, LO T670, LY T670, LG T670, LP T670 LSG T670, LSP T670, LSY T670, LOP T670, LYG T670 LG T671, LOG T671, LSG T671 LB T673, LV T673, LT T673, LW T673 LH T674 LS T676, LA T676, LO T676, LY T676, LB T676, LH T676, LSB T676, LW T676 LB T67C, LV T67C, LT T67C, LS T67K, LO T67K, LY T67K, LW E67C LS E67B, LA E67B, LO E67B, LY E67B, LB E67C, LV E67C, LT E67C LW T67C LS T679, LY T679, LG T679 LS T770, LO T770, LY T770, LG T770, LP T770 LB T773, LV T773, LT T773, LW T773 LH T774 LS E675, LA E675, LY E675, LS T675 LS T776, LA T776, LO T776, LY T776, LB T776 LHGB T686 LT T68C, LB T68C - Hyper Mini TOPLED® LB M676 - Mini TOPLED Santana® LG M470 LS M47K, LO M47K, LY M47K Source: http://www.osram.convergy.de LUXEON: - LUMILED® LXK2-PW12-R00, LXK2-PW12-S00, LXK2-PW14-U00, LXK2-PW14-V00 LXK2-PM12-R00, LXK2-PM12-S00, LXK2-PM14-U00 LXK2-PE12-Q00, LXK2-PE12-R00, LXK2-PE12-S00, LXK2-PE14-T00, LXK2-PE14-U00 LXK2-PB12-K00, LXK2-PB12-L00, LXK2-PB12-M00, LXK2-PB14-N00, LXK2-PB14-P00, LXK2-PB14-Q00 LXK2-PR12-L00, LXK2-PR12-M00, LXK2-PR14-Q00, LXK2-PR14-R00 LXK2-PD12-Q00, LXK2-PD12-R00, LXK2-PD12-S00 LXK2-PH12-R00, LXK2-PH12-S00 LXK2-PL12-P00, LXK2-PL12-Q00, LXK2-PL12-R00 Source: www.luxeon.com KINGBRIGHT: KA-3528ASYC Source: www.kingbright.com
MCU1 = RX62N:R5F562N8BDFP: Renesas RX62N microcomputer
Q4 = adafruit:MOSFET-N: N-Channel Mosfet 2N7002E - 60V 260mA SOT23 [Digikey: 2N7002ET1GOSTR-ND] - REEL BSH103 - 30V 850mA SOT23 [Digikey: 568-5013-1-ND]
R31 = pot:TRIM_US-: POTENTIOMETER
S6 = switch:TL32YO: TINY SWITCH ON - MOM Source: http://www2.produktinfo.conrad.com/datenblaetter/700000-724999/705152-da-01-de-Subminiaturschalter_TL_36YO.pdf
SG2 = buzzer:AL60P: SPEAKER Source: Buerklin; OC_FARNELL: unknown; OC_NEWARK: unknown
SJ1 SJ4 SJ5 = jumper:SJ: SMD solder JUMPER
U$1 U$14 U$15 U$24 U$27 U$29 U$30 U$80 = kerawo:GHTOP4
U$2 U$3 U$5 U$10-U$13 U$16 U$31-U$56 U$58 U$59 U$76 U$78 = CQ:FB1.25MM: MURATA Power Line Chip Ferrite Beads BLM21P <http://akizukidenshi.com/download/BLM21PG331SN.pdf> BLM21PG220SN1p 22Ω±25% 6000mA 0.01Ω -55℃～+125℃ BLM21PG300SN1p 30Ω(Typ.) 3000mA 0.015Ω -55℃～+125℃ BLM21PG600SN1p 60Ω±25% 3000mA 0.025Ω -55℃～+125℃ BLM21PG121SN1p 120Ω±25% 3000mA 0.03Ω -55℃～+125℃ BLM21PG221SN1p 220Ω±25% 2000mA 0.050Ω -55℃～+125℃ BLM21PG331SN1p 330Ω±25% 1500mA 0.09Ω -55℃～+125℃
U$4 = RX631:R5F5631FDDFP
U$6 U$8 = kerawo:TSHA-T-2
U$9 = kerawo:MUSB-5BF02AS-N
U$17 U$19 U$64 = kerawo:MCP2562
U$18 U$20 U$21 U$25 = 0Lib:RJ45
U$22 U$23 = kerawo:2DC-G213-B66
U$26 = CQ:NJM2845DL1: NJM Low Dropout Regulator 0.18V dropout at 500mA NJM2845 <http://semicon.njr.co.jp/jpn/PDF/NJM2845_NJM2846_J.pdf> Package <http://semicon.njr.co.jp/jpn/PDF/package/TO-252-3-L1_J.pdf>
U$28 U$57 = sd-card:DM3AT-SF-PEJ: HIROSE microSD socket DM3AT-SF-PEJ
U$61 U$62 = kerawo:FA238V
U$63 = 0Lib:USB-TYPEB
U$65 = kerawo:SC1602BBWB_PAD
U$66 U$69-U$74 U$81 = kerawo:TVBP06
U$67 U$75 U$77 = 0Lib:USB_A
U$68 = 0Lib:3STATE
U$79 = kerawo:KHS42
U$82 = kerawo:SSSS2
X2 = con-panduit:057-016-: CONNECTOR 10-pin series 057 contact pc board low profile headers; OC_FARNELL: unknown; OC_NEWARK: unknown
X3 = con-panduit:057-010-: CONNECTOR 10-pin series 057 contact pc board low profile headers; OC_FARNELL: unknown; OC_NEWARK: unknown